# Altium schematic sheet P04_ADCIND.SchDoc
size 301 x 239 mm
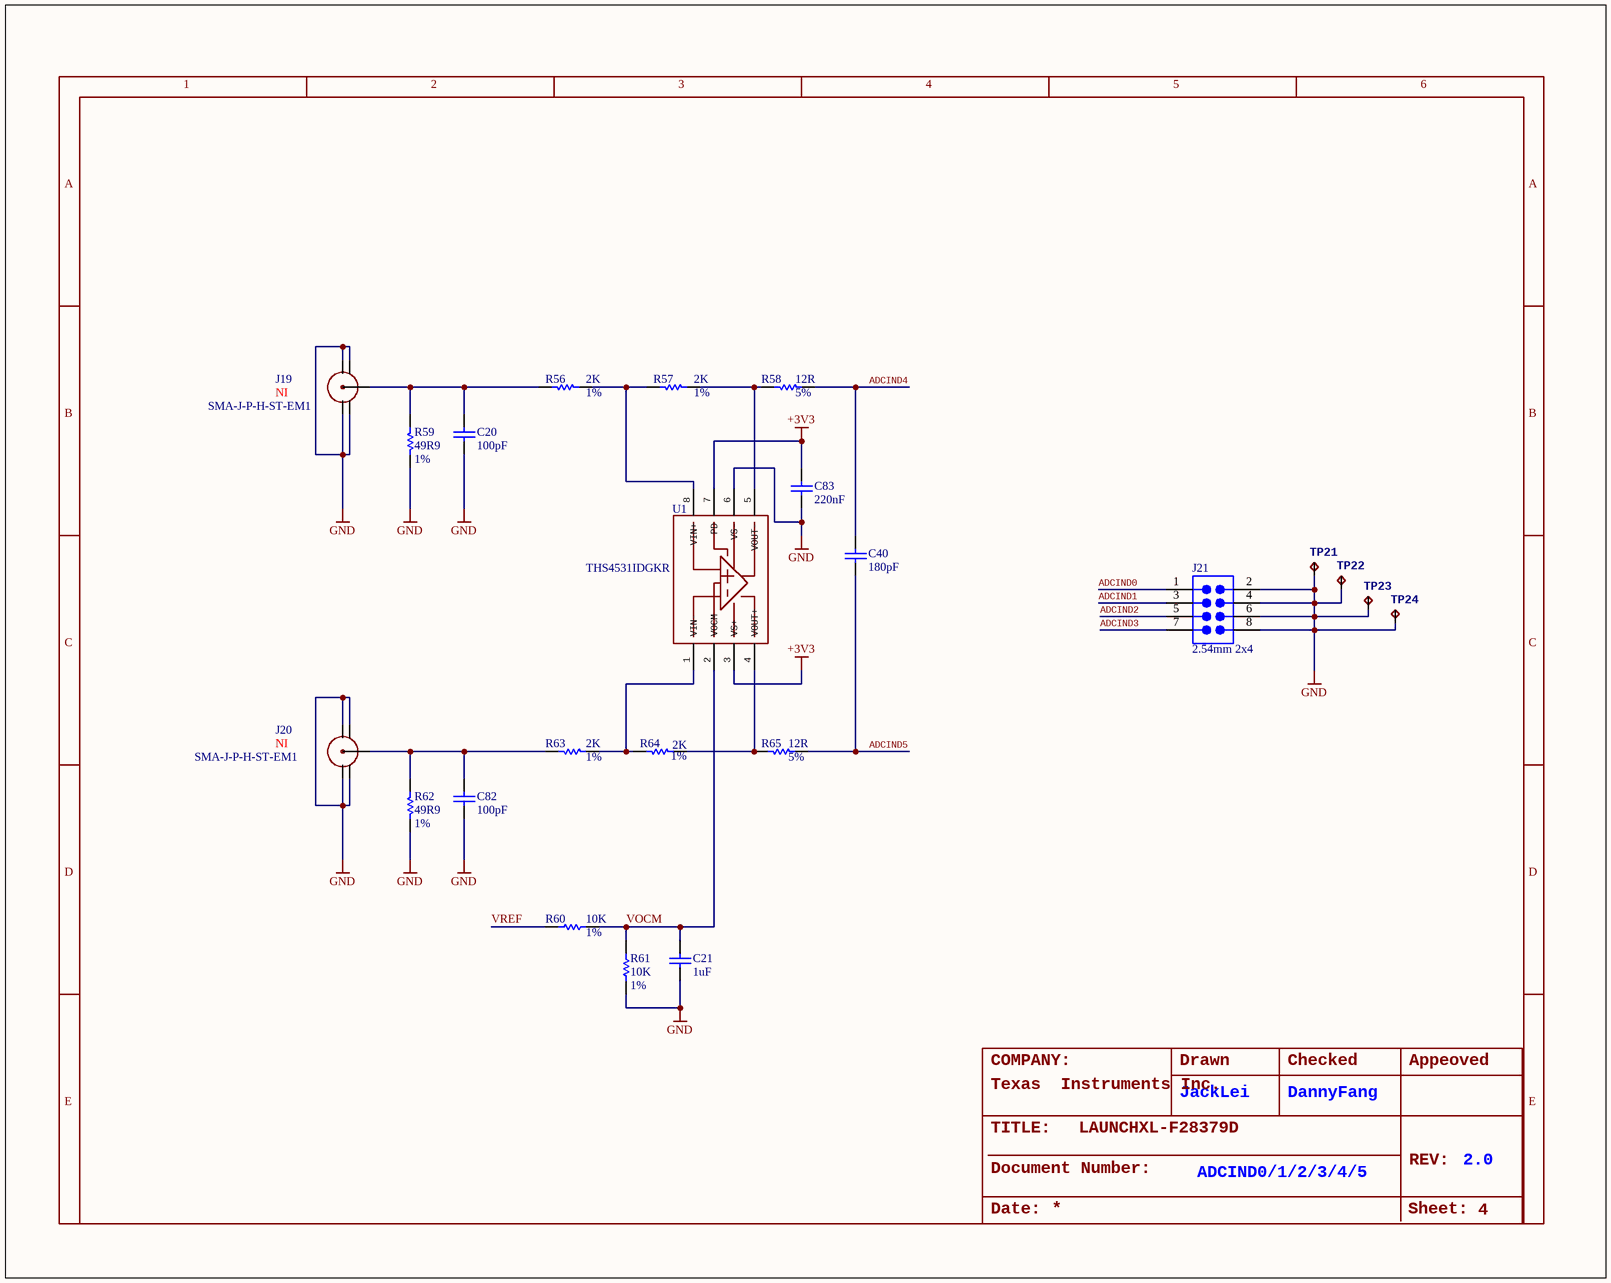
[diagram p0: P04_ADCIND.SchDoc]

## Parts
C20  100pF  [C0402]
C21  1uF  [C0402]
C40  180pF  [C0402]
C82  100pF  [C0402]
C83  220nF  [C0402]
J19  ASSY: NI  [SMA_EM]  (hidden comment: SMA-J-P-H-ST-EM1)
J20  ASSY: NI  [SMA_EM]  (hidden comment: SMA-J-P-H-ST-EM1)
J21  value 2.54mm 2x4  [HDRV8W64P254_2X4_1016X500X854P]  (hidden comment: P101-2*04SGF-116A-NX)
R56  Rating: 1%  [R0402]  (hidden comment: 2K)
R57  Rating: 1%  [R0402]  (hidden comment: 2K)
R58  Rating: 5%  [R0402]  (hidden comment: 12R)
R59  Rating: 1%  [R0402]  (hidden comment: 49R9)
R60  Rating: 1%  [R0402]  (hidden comment: 10K)
R61  Rating: 1%  [R0402]  (hidden comment: 10K)
R62  Rating: 1%  [R0402]  (hidden comment: 49R9)
R63  Rating: 1%  [R0402]  (hidden comment: 2K)
R64  Rating: 1%  [R0402]  (hidden comment: 2K)
R65  Rating: 5%  [R0402]  (hidden comment: 12R)
TP21  TESTPAD_TPB1,27  [TESTPAD_B1,27]  (value not drawn)
TP22  TESTPAD_TPB1,27  [TESTPAD_B1,27]  (value not drawn)
TP23  TESTPAD_TPB1,27  [TESTPAD_B1,27]  (value not drawn)
TP24  TESTPAD_TPB1,27  [TESTPAD_B1,27]  (value not drawn)
U1  THS4531IDGKR  [VSSOP65P490X110-8N]

## Nets
+3V3: C83.2 U1.3(VS+) U1.7(PD)
GND: C20.1 C21.1 C82.1 C83.1 J19.1 J19.3 J19.4 J19.5 J20.1 J20.3 J20.4 J20.5 J21.2 J21.4 J21.6 J21.8 R59.1 R61.2 R62.1 TP21.TP TP22.TP TP23.TP TP24.TP U1.6(VS-)
ADCIND0: J21.1
ADCIND1: J21.3
ADCIND2: J21.5
ADCIND3: J21.7
ADCIND4: C40.2 R58.1
ADCIND5: C40.1 R65.1
VOCM: C21.2 R60.2 R61.1 U1.2(VOCM)
VREF: R60.1
NetC20_2: C20.2 J19.2 R56.2 R59.2
NetC82_2: C82.2 J20.2 R62.2 R63.2
NetR56_1: R56.1 R57.2 U1.8(VIN+)
NetR57_1: R57.1 R58.2 U1.5(VOUT-)
NetR63_1: R63.1 R64.2 U1.1(VIN-)
NetR64_1: R64.1 R65.2 U1.4(VOUT+)

## Notes on the sheet
- COMPANY:
- Texas
  Instruments Inc.
- JackLei
- Drawn
- Checked
- DannyFang
- Appeoved
- TITLE:
- LAUNCHXL-F28379D
- REV:
- 2.0
- Date:
- Document Number:
- ADCIND0/1/2/3/4/5
- Sheet:
- 4
- 1
- 2
- 3
- 5
- 6
- A
- B
- C
- D
- E

## Library data of the parts
C20 C82 = 1004001100017: CAP,100PF,+/-5%,C0G,50V,SMD0402; Manufacturer: MURATA; Manufacturer Part Number: GRM1555C1H101JA01D; Rating: 5%; Embest PN: 1004001100017; Value: 100pF; Part Type: Ceramic Capacitor
C21 = 1004001100056: CAP,1UF,+/-10%,X5R,6.3V,SMD0402; Manufacturer: MURATA; Manufacturer Part Number: GRM155R60J105KE19D; Rating: 10%; Embest PN: 1004001100056; Value: 1uF; Part Type: Ceramic Capacitor
C40 = 1004001100020: CAP,180PF,+/-5%,C0G,50V,SMD0402; Manufacturer: MURATA; Manufacturer Part Number: GRM1555C1H181JA01D; Rating: 5%; Embest PN: 1004001100020; Value: 180pF; Part Type: Ceramic Capacitor
C83 = 1004001100050: CAP,220NF,+/-10%,X5R,10V,SMD0402; Manufacturer: MURATA; Manufacturer Part Number: GRM155R61A224KE19D; Rating: 10%; Embest PN: 1004001100050; Value: 220nF; Part Type: Ceramic Capacitor
J19 J20 = 1009019100017: RF Connector,SMA Jack, Edge Mount, Gold, Straight, 50Ω,SMD,Tray; Manufacturer: SAMTEC; Embest PN: 1009019100017; Value: SMA-J-P-H-ST-EM1; Part Type: RF Connector; Manufacturer Part Number: SMA-J-P-H-ST-EM1
J21 = 1009001200025: Connector,Pin Header,Straight,Male,2x4Pin,2.54MM pitch,6.06,3.00,Gold Flash 1u, black,DIP; Manufacturer: TOWNES; Embest PN: 1009001200025; Part Type: Pin Header; Manufacturer Part Number: P101-2*04SGF-116A-NX
R56 R57 R63 R64 = 1003001100044: RES,2K,+/-1%,1/16W,SMD0402; Manufacturer: YAGEO; Manufacturer Part Number: RC0402FR-072KL; Embest PN: 1003001100044; Value: 2K; Part Type: Thick film Resistor
R58 R65 = 1003001101032: RES SMD 12 OHM 5% 1/16W 0402 TR; Manufacturer: VISHAY; Manufacturer Part Number: CRCW040212R0JNED; Embest PN: 1003001101032; Value: 12R; Part Type: Thick film Resistor
R59 R62 = 1003001100015: RES,49R9,+/-1%,1/16W,SMD0402; Manufacturer: YAGEO; Manufacturer Part Number: RC0402FR-0749R9L; Embest PN: 1003001100015; Value: 49R9; Part Type: Thick film Resistor
R60 R61 = 1003001100071: RES,10K,+/-1%,1/16W,SMD0402; Manufacturer: YAGEO; Manufacturer Part Number: RC0402FR-0710KL; Embest PN: 1003001100071; Value: 10K; Part Type: Thick film Resistor
TP21-TP24 = TESTPAD_TPB1,27: Test pad
U1 = 1002007100055C: IC OPAMP DIFF 27MHZ RRO 8VSSOP TR; Manufacturer: TI; Embest PN: 1002007100055C; Value: THS4531IDGKR; Part Type: Amplifier; Manufacturer Part Number: THS4531IDGKR